# Altium schematic sheet SoM.SchDoc
size A2; SheetNumber: 2; SheetTotal: 9
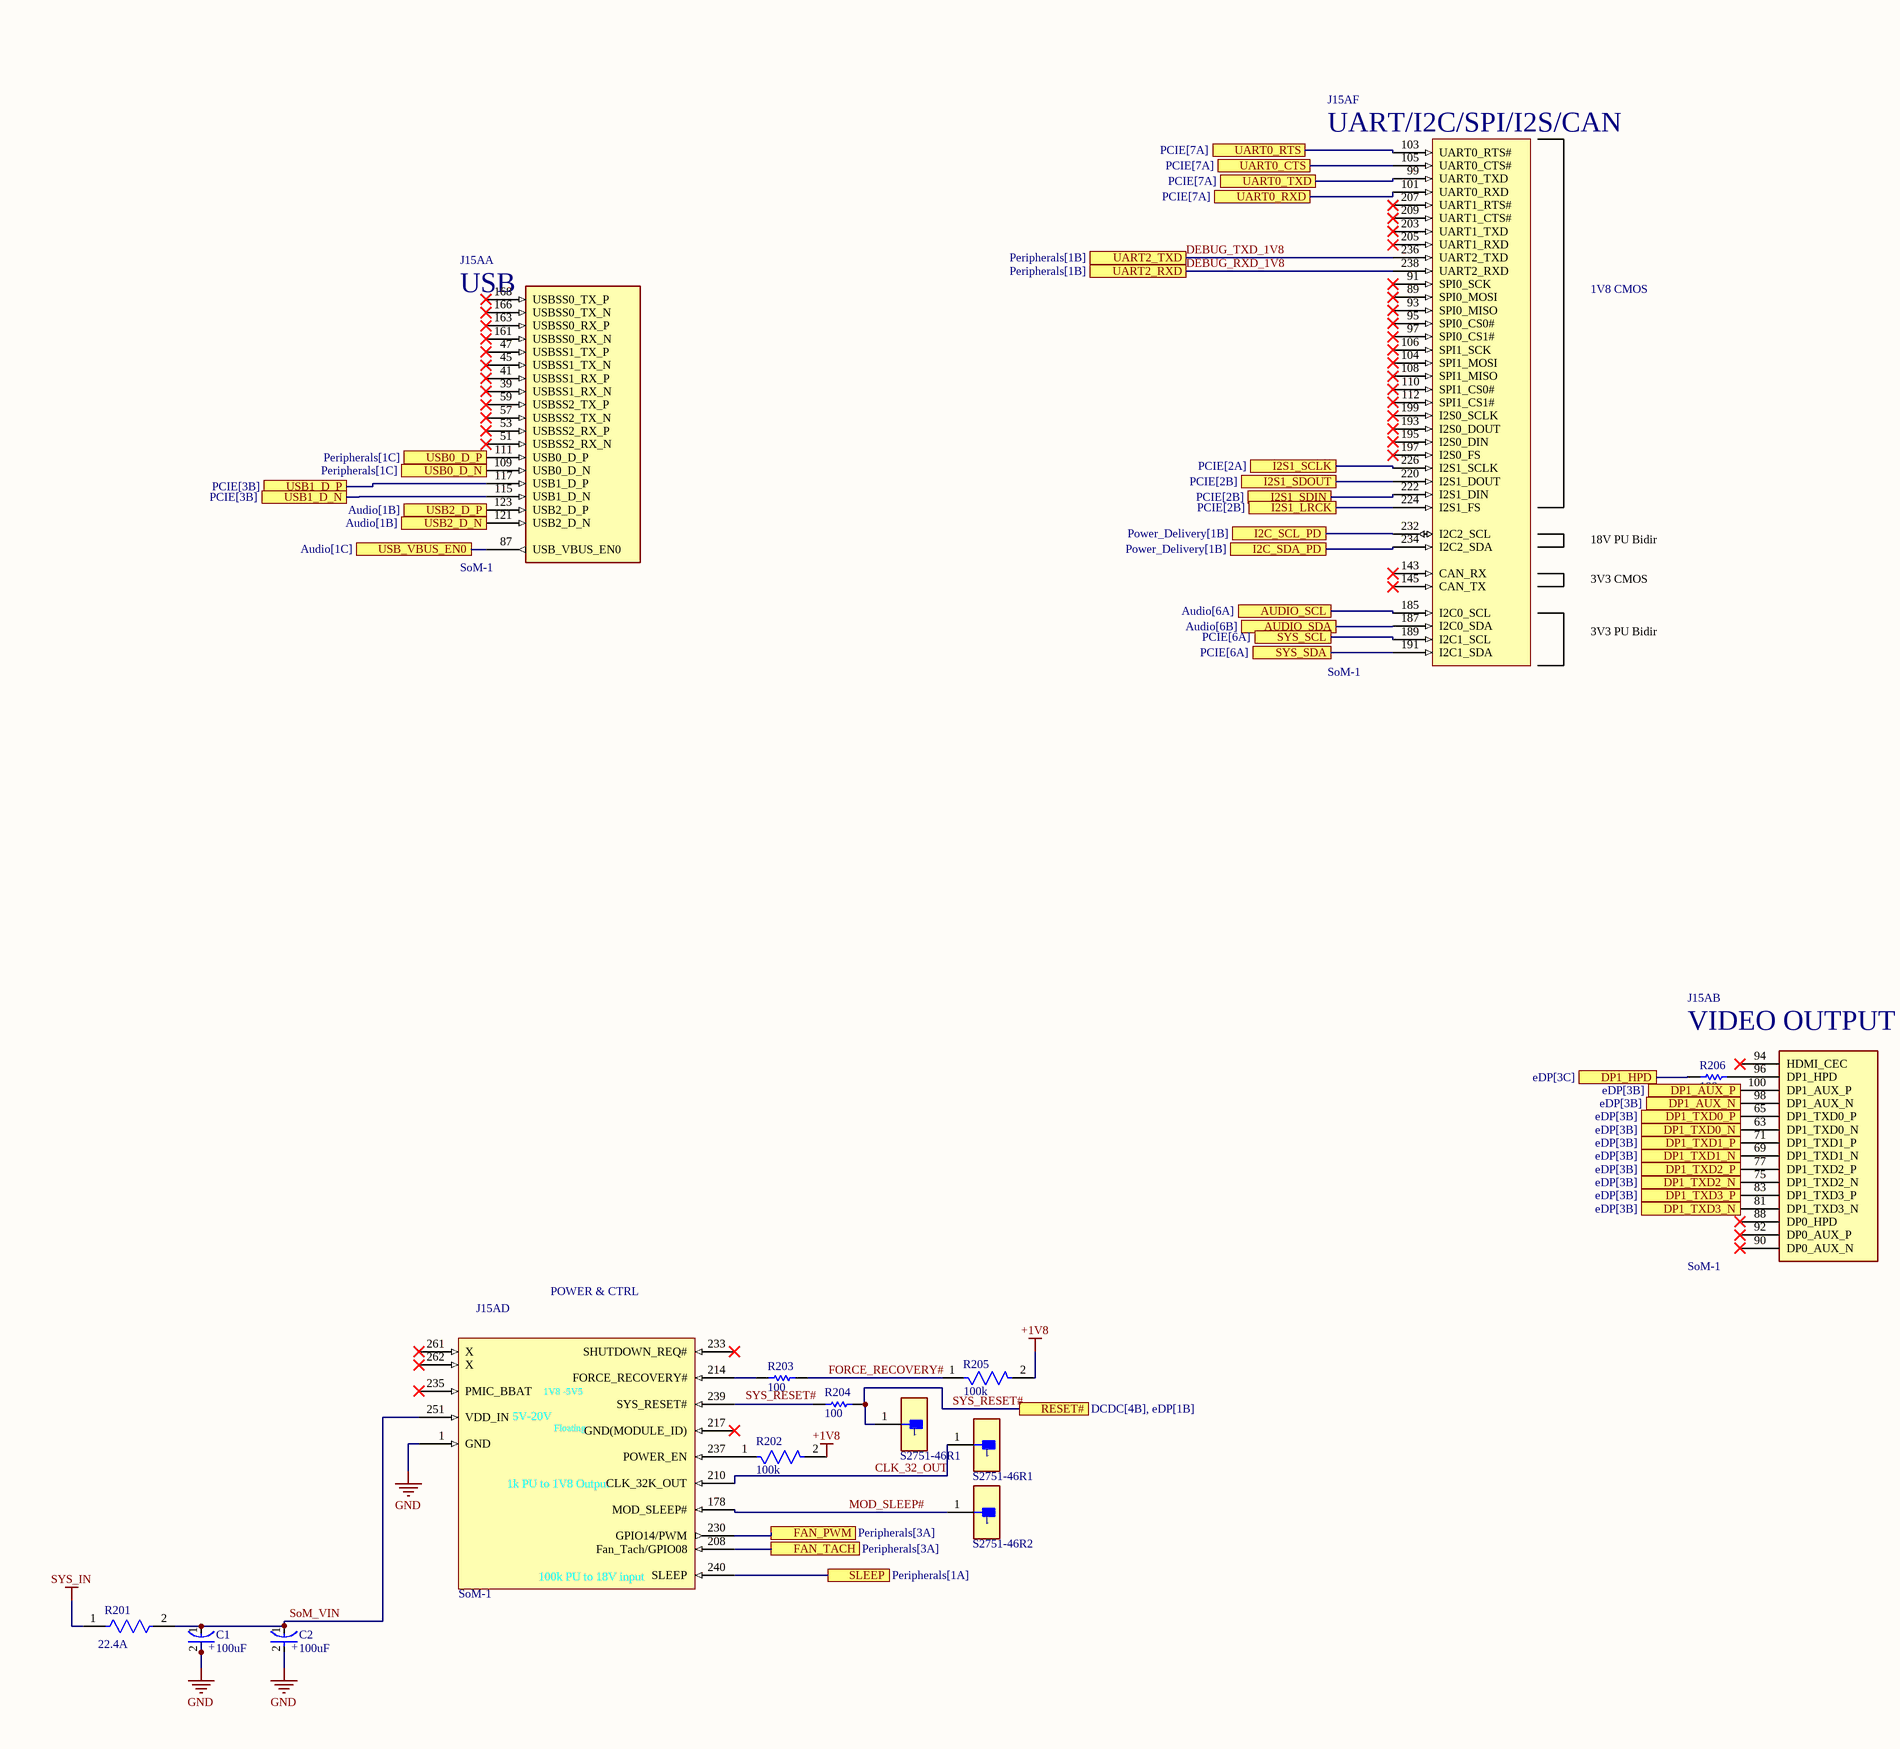
[diagram p0: SoM.SchDoc, left]
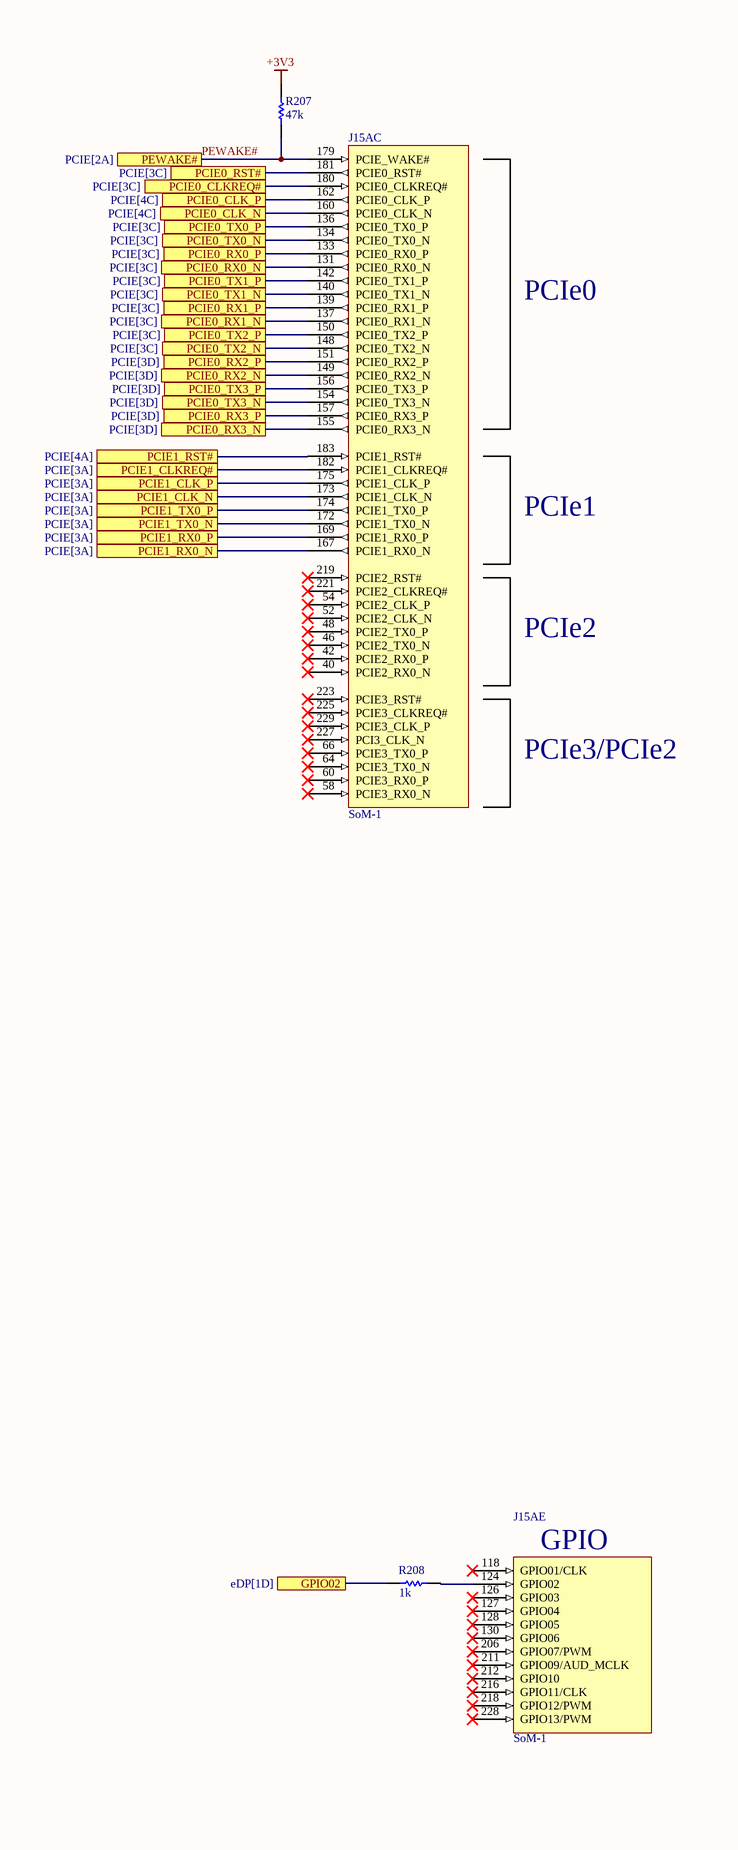
[diagram p1: SoM.SchDoc, right]

## Parts
C1  100uF  [FP-T521D107M025ATE040-MFG]
C2  100uF  [FP-T521D107M025ATE040-MFG]
J15A  SoM-1  [FP-2309413-1-MFG]  (parts A,B,C,D,E,F of 8)
J201  S2751-46R1  [FP-S2751-46R-MFG]
J202  S2751-46R1  [FP-S2751-46R-MFG]
J203  S2751-46R2  [FP-S2751-46R-MFG]
R201  22.4A  [FP-HCJ0603-MFG]
R202  100k  [FP-RC0402-0_4-IPC_A]
R203  100  [RESC1005X40X25ML05T10]
R204  100  [RESC1005X40X25ML05T10]
R205  100k  [FP-RC0402-0_4-IPC_A]
R206  100  [RESC1005X40X25ML05T10]
R207  47k  [RESC1005X40X25ML05T10]
R208  1k  [RESC3216X60X45ML15T20]

## Ports
AUDIO_SCL (see Audio[6A]), AUDIO_SDA (see Audio[6B]), DP1_AUX_N (see eDP[3B]), DP1_AUX_P (see eDP[3B]), DP1_HPD (see eDP[3C]), DP1_TXD0_N (see eDP[3B]), DP1_TXD0_P (see eDP[3B]), DP1_TXD1_N (see eDP[3B]), DP1_TXD1_P (see eDP[3B]), DP1_TXD2_N (see eDP[3B]), DP1_TXD2_P (see eDP[3B]), DP1_TXD3_N (see eDP[3B]), DP1_TXD3_P (see eDP[3B]), FAN_PWM (see Peripherals[3A]), FAN_TACH (see Peripherals[3A]), GPIO02 (see eDP[1D]), I2C_SCL_PD (see Power_Delivery[1B]), I2C_SDA_PD (see Power_Delivery[1B]), I2S1_LRCK (see PCIE[2B]), I2S1_SCLK (see PCIE[2A]), I2S1_SDIN (see PCIE[2B]), I2S1_SDOUT (see PCIE[2B]), PCIE0_CLK_N (see PCIE[4C]), PCIE0_CLK_P (see PCIE[4C]), PCIE0_CLKREQ# (see PCIE[3C]), PCIE0_RST# (see PCIE[3C]), PCIE0_RX0_N (see PCIE[3C]), PCIE0_RX0_P (see PCIE[3C]), PCIE0_RX1_N (see PCIE[3C]), PCIE0_RX1_P (see PCIE[3C]), PCIE0_RX2_N (see PCIE[3D]), PCIE0_RX2_P (see PCIE[3D]), PCIE0_RX3_N (see PCIE[3D]), PCIE0_RX3_P (see PCIE[3D]), PCIE0_TX0_N (see PCIE[3C]), PCIE0_TX0_P (see PCIE[3C]), PCIE0_TX1_N (see PCIE[3C]), PCIE0_TX1_P (see PCIE[3C]), PCIE0_TX2_N (see PCIE[3C]), PCIE0_TX2_P (see PCIE[3C]), PCIE0_TX3_N (see PCIE[3D]), PCIE0_TX3_P (see PCIE[3D]), PCIE1_CLK_N (see PCIE[3A]), PCIE1_CLK_P (see PCIE[3A]), PCIE1_CLKREQ# (see PCIE[3A]), PCIE1_RST# (see PCIE[4A]), PCIE1_RX0_N (see PCIE[3A]), PCIE1_RX0_P (see PCIE[3A]), PCIE1_TX0_N (see PCIE[3A]), PCIE1_TX0_P (see PCIE[3A]), PEWAKE# (see PCIE[2A]), RESET# (see DCDC[4B], eDP[1B]), SLEEP (see Peripherals[1A]), SYS_SCL (see PCIE[6A]), SYS_SDA (see PCIE[6A]), UART0_CTS (see PCIE[7A]), UART0_RTS (see PCIE[7A]), UART0_RXD (see PCIE[7A]), UART0_TXD (see PCIE[7A]), UART2_RXD (see Peripherals[1B]), UART2_TXD (see Peripherals[1B]), USB0_D_N (see Peripherals[1C]), USB0_D_P (see Peripherals[1C]), USB1_D_N (see PCIE[3B]), USB1_D_P (see PCIE[3B]), USB2_D_N (see Audio[1B]), USB2_D_P (see Audio[1B]), USB_VBUS_EN0 (see Audio[1C])

## Nets
+1V8: R202.2 R205.2
+3V3: R207.2
GND: C1.2(A) C2.2(A) J15A.1(GND)
SYS_IN: R201.1
AUDIO_SCL: J15A.185(I2C0_SCL) ; port AUDIO_SCL
AUDIO_SDA: J15A.187(I2C0_SDA) ; port AUDIO_SDA
CLK_32_OUT: J15A.210(CLK_32K_OUT) J202.1
DEBUG_RXD_1V8: J15A.238(UART2_RXD) ; port UART2_RXD
DEBUG_TXD_1V8: J15A.236(UART2_TXD) ; port UART2_TXD
DP1_AUX_N: J15A.98(DP1_AUX_N) ; port DP1_AUX_N
DP1_AUX_P: J15A.100(DP1_AUX_P) ; port DP1_AUX_P
DP1_HPD: R206.1 ; port DP1_HPD
DP1_TXD0_N: J15A.63(DP1_TXD0_N) ; port DP1_TXD0_N
DP1_TXD0_P: J15A.65(DP1_TXD0_P) ; port DP1_TXD0_P
DP1_TXD1_N: J15A.69(DP1_TXD1_N) ; port DP1_TXD1_N
DP1_TXD1_P: J15A.71(DP1_TXD1_P) ; port DP1_TXD1_P
DP1_TXD2_N: J15A.75(DP1_TXD2_N) ; port DP1_TXD2_N
DP1_TXD2_P: J15A.77(DP1_TXD2_P) ; port DP1_TXD2_P
DP1_TXD3_N: J15A.81(DP1_TXD3_N) ; port DP1_TXD3_N
DP1_TXD3_P: J15A.83(DP1_TXD3_P) ; port DP1_TXD3_P
FAN_PWM: J15A.230(GPIO14/PWM) ; port FAN_PWM
FAN_TACH: J15A.208(Fan_Tach/GPIO08) ; port FAN_TACH
FORCE_RECOVERY#: R203.2 R205.1
GPIO02: R208.2 ; port GPIO02
I2C_SCL_PD: J15A.232(I2C2_SCL) ; port I2C_SCL_PD
I2C_SDA_PD: J15A.234(I2C2_SDA) ; port I2C_SDA_PD
I2S1_LRCK: J15A.224(I2S1_FS) ; port I2S1_LRCK
I2S1_SCLK: J15A.226(I2S1_SCLK) ; port I2S1_SCLK
I2S1_SDIN: J15A.222(I2S1_DIN) ; port I2S1_SDIN
I2S1_SDOUT: J15A.220(I2S1_DOUT) ; port I2S1_SDOUT
MOD_SLEEP#: J15A.178(MOD_SLEEP#) J203.1
PCIE0_CLK_N: J15A.160(PCIE0_CLK_N) ; port PCIE0_CLK_N
PCIE0_CLK_P: J15A.162(PCIE0_CLK_P) ; port PCIE0_CLK_P
PCIE0_CLKREQ#: J15A.180(PCIE0_CLKREQ#) ; port PCIE0_CLKREQ#
PCIE0_RST#: J15A.181(PCIE0_RST#) ; port PCIE0_RST#
PCIE0_RX0_N: J15A.131(PCIE0_RX0_N) ; port PCIE0_RX0_N
PCIE0_RX0_P: J15A.133(PCIE0_RX0_P) ; port PCIE0_RX0_P
PCIE0_RX1_N: J15A.137(PCIE0_RX1_N) ; port PCIE0_RX1_N
PCIE0_RX1_P: J15A.139(PCIE0_RX1_P) ; port PCIE0_RX1_P
PCIE0_RX2_N: J15A.149(PCIE0_RX2_N) ; port PCIE0_RX2_N
PCIE0_RX2_P: J15A.151(PCIE0_RX2_P) ; port PCIE0_RX2_P
PCIE0_RX3_N: J15A.155(PCIE0_RX3_N) ; port PCIE0_RX3_N
PCIE0_RX3_P: J15A.157(PCIE0_RX3_P) ; port PCIE0_RX3_P
PCIE0_TX0_N: J15A.134(PCIE0_TX0_N) ; port PCIE0_TX0_N
PCIE0_TX0_P: J15A.136(PCIE0_TX0_P) ; port PCIE0_TX0_P
PCIE0_TX1_N: J15A.140(PCIE0_TX1_N) ; port PCIE0_TX1_N
PCIE0_TX1_P: J15A.142(PCIE0_TX1_P) ; port PCIE0_TX1_P
PCIE0_TX2_N: J15A.148(PCIE0_TX2_N) ; port PCIE0_TX2_N
PCIE0_TX2_P: J15A.150(PCIE0_TX2_P) ; port PCIE0_TX2_P
PCIE0_TX3_N: J15A.154(PCIE0_TX3_N) ; port PCIE0_TX3_N
PCIE0_TX3_P: J15A.156(PCIE0_TX3_P) ; port PCIE0_TX3_P
PCIE1_CLK_N: J15A.173(PCIE1_CLK_N) ; port PCIE1_CLK_N
PCIE1_CLK_P: J15A.175(PCIE1_CLK_P) ; port PCIE1_CLK_P
PCIE1_CLKREQ#: J15A.182(PCIE1_CLKREQ#) ; port PCIE1_CLKREQ#
PCIE1_RST#: J15A.183(PCIE1_RST#) ; port PCIE1_RST#
PCIE1_RX0_N: J15A.167(PCIE1_RX0_N) ; port PCIE1_RX0_N
PCIE1_RX0_P: J15A.169(PCIE1_RX0_P) ; port PCIE1_RX0_P
PCIE1_TX0_N: J15A.172(PCIE1_TX0_N) ; port PCIE1_TX0_N
PCIE1_TX0_P: J15A.174(PCIE1_TX0_P) ; port PCIE1_TX0_P
PEWAKE#: J15A.179(PCIE_WAKE#) R207.1 ; port PEWAKE#
SLEEP: J15A.240(SLEEP) ; port SLEEP
SoM_VIN: C1.1(C) C2.1(C) J15A.251(VDD_IN) R201.2
SYS_RESET#: J201.1 R204.2 ; port RESET#
SYS_SCL: J15A.189(I2C1_SCL) ; port SYS_SCL
SYS_SDA: J15A.191(I2C1_SDA) ; port SYS_SDA
UART0_CTS: J15A.105(UART0_CTS#) ; port UART0_CTS
UART0_RTS: J15A.103(UART0_RTS#) ; port UART0_RTS
UART0_RXD: J15A.101(UART0_RXD) ; port UART0_RXD
UART0_TXD: J15A.99(UART0_TXD) ; port UART0_TXD
USB0_D_N: J15A.109(USB0_D_N) ; port USB0_D_N
USB0_D_P: J15A.111(USB0_D_P) ; port USB0_D_P
USB1_D_N: J15A.115(USB1_D_N) ; port USB1_D_N
USB1_D_P: J15A.117(USB1_D_P) ; port USB1_D_P
USB2_D_N: J15A.121(USB2_D_N) ; port USB2_D_N
USB2_D_P: J15A.123(USB2_D_P) ; port USB2_D_P
USB_VBUS_EN0: J15A.87(USB_VBUS_EN0) ; port USB_VBUS_EN0
NetJ15A_96: J15A.96(DP1_HPD) R206.2
NetJ15A_124: J15A.124(GPIO02) R208.1
NetJ15A_214: J15A.214(FORCE_RECOVERY#) R203.1
NetJ15A_237: J15A.237(POWER_EN) R202.1
NetJ15A_239: J15A.239(SYS_RESET#) R204.1

Not connected (* = marked no-connect by the designer): J15A 39(USBSS1_RX_N)* 40(PCIE2_RX0_N)* 41(USBSS1_RX_P)* 42(PCIE2_RX0_P)* 45(USBSS1_TX_N)* 46(PCIE2_TX0_N)* 47(USBSS1_TX_P)* 48(PCIE2_TX0_P)* 51(USBSS2_RX_N)* 52(PCIE2_CLK_N)* 53(USBSS2_RX_P)* 54(PCIE2_CLK_P)* 57(USBSS2_TX_N)* 58(PCIE3_RX0_N)* 59(USBSS2_TX_P)* 60(PCIE3_RX0_P)* 64(PCIE3_TX0_N)* 66(PCIE3_TX0_P)* 88(DP0_HPD)* 89(SPI0_MOSI)* 90(DP0_AUX_N)* 91(SPI0_SCK)* 92(DP0_AUX_P)* 93(SPI0_MISO)* 94(HDMI_CEC)* 95(SPI0_CS0#)* 97(SPI0_CS1#)* 104(SPI1_MOSI)* 106(SPI1_SCK)* 108(SPI1_MISO)* 110(SPI1_CS0#)* 112(SPI1_CS1#)* 118(GPIO01/CLK)* 126(GPIO03)* 127(GPIO04)* 128(GPIO05)* 130(GPIO06)* 143(CAN_RX)* 145(CAN_TX)* 161(USBSS0_RX_N)* 163(USBSS0_RX_P)* 166(USBSS0_TX_N)* 168(USBSS0_TX_P)* 193(I2S0_DOUT)* 195(I2S0_DIN)* 197(I2S0_FS)* 199(I2S0_SCLK)* 203(UART1_TXD)* 205(UART1_RXD)* 206(GPIO07/PWM)* 207(UART1_RTS#)* 209(UART1_CTS#)* 211(GPIO09/AUD_MCLK)* 212(GPIO10)* 216(GPIO11/CLK)* 217(GND(MODULE_ID))* 218(GPIO12/PWM)* 219(PCIE2_RST#)* 221(PCIE2_CLKREQ#)* 223(PCIE3_RST#)* 225(PCIE3_CLKREQ#)* 227(PCI3_CLK_N)* 228(GPIO13/PWM)* 229(PCIE3_CLK_P)* 233(SHUTDOWN_REQ#)* 235(PMIC_BBAT)* 261(X)* 262(X)*

## Notes on the sheet
- (near J15A) 1V8 -5V5
- (near J15A) 5V-20V
- (near J15A) Floating
- (near J15A) 1k PU to 1V8 Output
- (near J15A) 100k PU to 18V input
- Labels drawn without touching a wire or pin: SYS_RESET#
- (in symbol CMP-00001-1, part A) USB
- (in symbol CMP-00001-1, part B) VIDEO OUTPUT (eDP)
- (in symbol CMP-00001-1, part C) PCIe0; PCIe1; PCIe2; PCIe3/PCIe2
- (in symbol CMP-00001-1, part D) POWER & CTRL
- (in symbol CMP-00001-1, part E) GPIO
- (in symbol CMP-00001-1, part F) UART/I2C/SPI/I2S/CAN; 1V8 CMOS; 18V PU Bidir; 3V3 CMOS; 3V3 PU Bidir
- (in symbol CMP-03016-000026-1) +

## Library data of the parts
C1 C2 = CMP-03016-000026-1: CAP TANT POLY 100UF 25V 2917; Tolerance: 20%; ESR (Equivalent Series Resistance): 40mR; Min Operating Temperature: -55°C; Voltage Rating: 25V; Width: 0.169inch; Case Code (Imperial): 2917; Packaging: Cut Tape; Max Operating Temperature: 105°C; Length: 0.287inch; Capacitance: 100uF; Voltage Rating (DC): 25V; Features: General Purpose; REACH SVHC: No SVHC; Height - Seated (Max): 0.122inch; Series: KO-CAP® T521; Case/Package: 2917; Case Code (Metric): 7343; Mount: Surface Mount
J15A = CMP-00001-1: Memory Card Connector, DDR4, SODIMM, Cam-In Locking, 260 Contacts, Copper Alloy; Manufacturer Lifecycle Status: ACTIVE; Number of Contacts: 260; Pitch: 500µm; Circuit Application: Power; Voltage Rating: 25V; Max Current Rating: 500mA; Dielectric Material: Polyethylene; Row Spacing: 8.2mm; Shielding: No; Memory Format: DDR, SDRAM; Number of Ports: 1; Contact Material: Gold, Nickel; Lifecycle Status: Production; Packaging: Tape & Reel; Mounting Technology: Surface Mount; Contact Gender: Female; Flammability Rating: UL94 V-0; Height: 18.8mm; Source: 4d1075b24ee2591bdcd47d674b3d2aa.SchLib; Pins: 260; Min Operating Temperature: -55°C; Orientation: Right Angle; Housing Color: Black; Housing Material: Thermoplastic; Sealable: No; Number of Positions: 260; Current Rating: 500mA; RoHS: Compliant; Number of Rows: 2; Contact Plating: Gold, Nickel; China RoHS: Compliant; Terminal Pitch: 500µm; Max Operating Temperature: 85°C; Contact Current Rating: 500mA; Schedule B: 8536694040, 8536694040; REACH SVHC: Yes
J201-J203 = CMP-15817-000010-1: PC TEST POINT NATURAL; Plating: Tin; Body Material: Brass; Color: Natural; Material: Copper Alloy; Mount: Surface Mount; Packaging: Cut Tape
R201 = CMP-26527-000122-1: RES 0 OHM JUMPER 1/4W 0603; Resistance: 0mR; Termination: Wraparound; Mount: Surface Mount; Min Operating Temperature: -55°C; Number of Terminations: 2; Packaging: Tape and Reel; Case Code (Imperial): 0603; Height: 0.021inch; RoHS Compliant: Yes; Width: 0.031inch; Package Quantity: 5000; Max Operating Temperature: 155°C; Radiation Hardening: No; Case/Package: 0603; Length: 0.061inch; Case Code (Metric): 1608
R202 R205 = CMP-2002-07913-2: RES 100K OHM 5% 1/16W 0402; Temperature Coefficient: 100ppm/°C; Max Power Dissipation: 63mW; Resistance: 100kR; Voltage Rating: 50V; Tolerance: 5%; Packaging: Tape and Reel; Termination: SMD/SMT; Case Code (Metric): 1005; Length: 1mm; Power Rating: 63mW; Min Operating Temperature: -55°C; Case/Package: 0402; Construction: Rectangular; Series: RC; Resistance Tolerance: 5%; Height: 0.016inch; Case Code (Imperial): 0402; RoHS Compliant: Yes; Size Code: 0402; Number of Terminations: 2; Features: Moisture Resistant; Width: 0.02inch; Max Operating Temperature: 155°C; Military Standard: Not; Lead Free: Lead Free; Depth: 0.5mm; Package Quantity: 1; Resistor Type: Thick Film
R203 R204 R206 = CMP-2002-07344-1: Part Number: RC0402FR-07100RL; Manufacturer: Yageo / Phycomp
R207 = CMP-2002-07701-1: Part Number: RC0402FR-0747KL; Manufacturer: Yageo / Phycomp
R208 = CMP-2100-03616-1: Chip Resistor, 1 KOhm, +/- 1%, 0.25 W, -55 to 155 degC, 1206 (3216 Metric), RoHS, Tape and Reel; Manufacturer: Vishay Semiconductor; Power Rating: 250mW; Voltage Rating (DC): 200V; Resistance: 1KOhm; Temperature Coefficient: 100ppm/degreesC; Case Code (Imperial): 1206; Length: 3.2mm; Case/Package: 1206; Contact Plating: Tin; Package Quantity: 10; Datasheet URL: http://www.farnell.com/datasheets/1720486.pdf; Mount: SurfaceMount; Package Description: 2-Pin Surface Mount Device, Body 3.15 x 1.6 mm; Package Reference: 1206.0; Max Operating Temperature: 155degC; Lead Free: LeadFree; Weight: 0.000353oz; Military Standard: Not; Max Power Dissipation: 250mW; Case Code (Metric): 3216; Number of Terminations: 2; Tolerance: 1%; Width: 0.063inch; Termination: SMD/SMT; Number of Pins: 2; Min Operating Temperature: -55degC; Height: 0.55mm; Depth: 1.6mm; RoHSCompliant: true; Composition: ThickFilm; Packaging: TapeandReel; Manufacturer URL: http://www.vishay.com/; Voltage Rating: 200V; Radiation Hardening: No; REACH SVHC: Unknown; Datasheet Version: 41061.0